# Altium schematic sheet SmokeDetector.SchDoc: Smoke Detector Top Sheet
size A; SheetNumber: 1; SheetTotal: 5
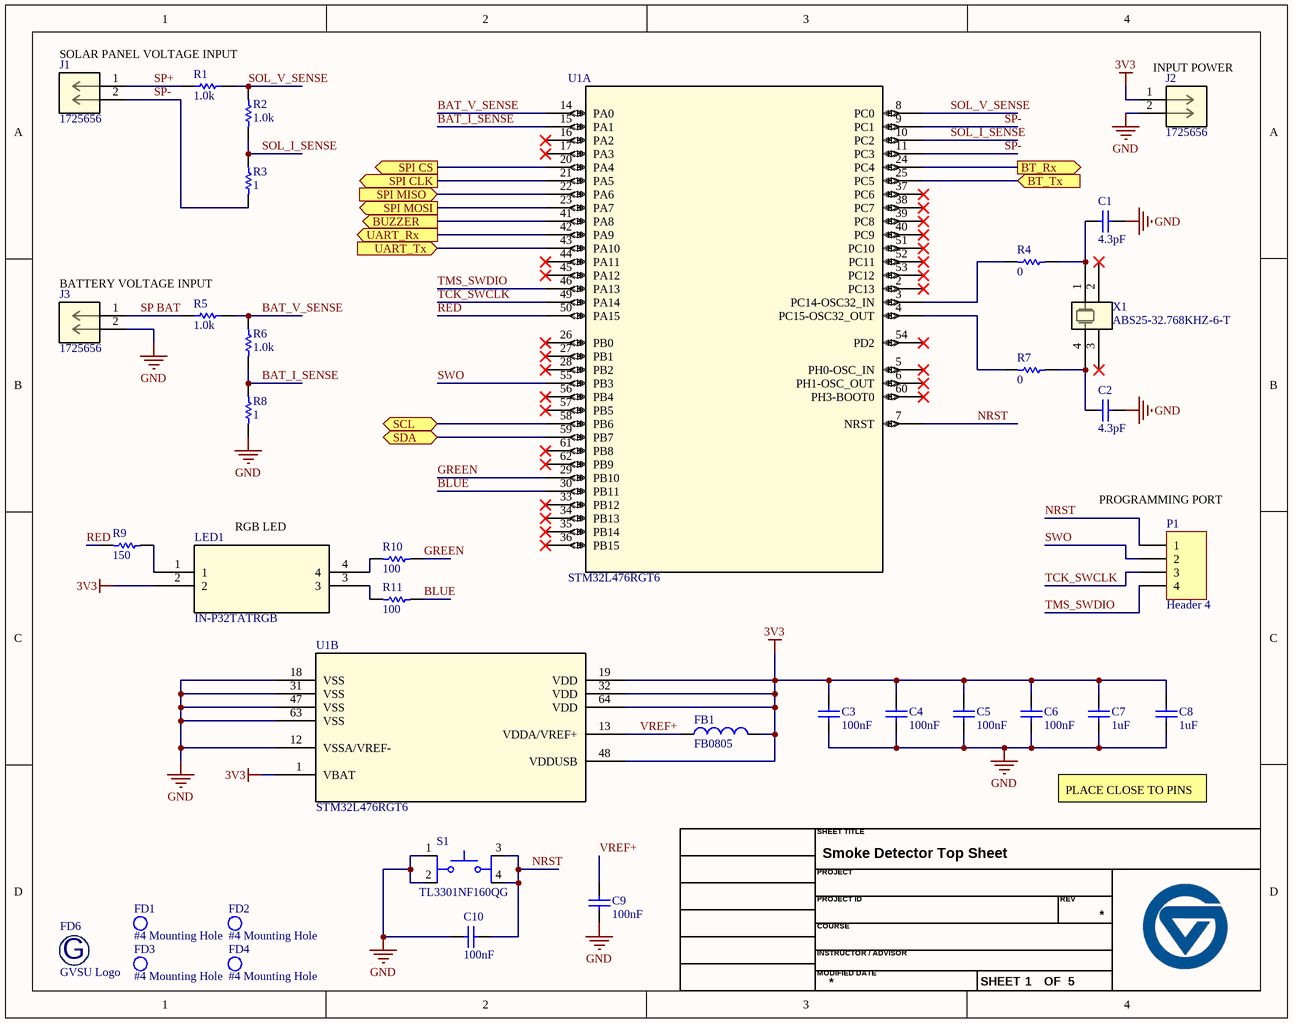
[diagram p0: SmokeDetector.SchDoc]

## Parts
C1  value 4.3pF  [0402cap]  (hidden comment: C0402)
C2  value 4.3pF  [0402cap]  (hidden comment: C0402)
C3  value 100nF  [0402cap]  (hidden comment: C0402)
C4  value 100nF  [0402cap]  (hidden comment: C0402)
C5  value 100nF  [0402cap]  (hidden comment: C0402)
C6  value 100nF  [0402cap]  (hidden comment: C0402)
C7  value 1uF  [0402cap]  (hidden comment: C0402)
C8  value 1uF  [0805CAP]  (hidden comment: C0805)
C9  value 100nF  [0402cap]  (hidden comment: C0402)
C10  value 100nF  [0402cap]  (hidden comment: C0402)
FB1  FB0805  [0805CAP]
FD1  #4 Mounting Hole  [#4 Mounting Hole-Footprint-1]  (no BOM)
FD2  #4 Mounting Hole  [#4 Mounting Hole-Footprint-1]  (no BOM)
FD3  #4 Mounting Hole  [#4 Mounting Hole-Footprint-1]  (no BOM)
FD4  #4 Mounting Hole  [#4 Mounting Hole-Footprint-1]  (no BOM)
FD6  GVSU Logo  [GVSU Symbol Only]  (no BOM)
J1  1725656  [CONN_1725656_PXC]
J2  1725656  [CONN_1725656_PXC]
J3  1725656  [CONN_1725656_PXC]
LED1  IN-P32TATRGB  [4-PLCC_3P2X2P8_INL]
P1  Header 4  [HDR1X4]
R1  value 1.0k  [0805RES]  (hidden comment: R0805)
R2  value 1.0k  [0805RES]  (hidden comment: R0805)
R3  value 1  [0805RES]  (hidden comment: R0805)
R4  value 0  [0402RES]  (hidden comment: R0402)
R5  value 1.0k  [0805RES]  (hidden comment: R0805)
R6  value 1.0k  [0805RES]  (hidden comment: R0805)
R7  value 0  [0402RES]  (hidden comment: R0402)
R8  value 1  [0805RES]  (hidden comment: R0805)
R9  value 150  [0805RES]  (hidden comment: R0805)
R10  value 100  [0805RES]  (hidden comment: R0805)
R11  value 100  [0805RES]  (hidden comment: R0805)
S1  TL3301NF160QG  [SW_TL3301NF160QG]
U1  STM32L476RGT6  [LQFP64-10x10mm_STM]  (parts A,B of 2)
X1  ABS25-32.768KHZ-6-T  [X_ABS25_ABR]

## Ports
BT_Rx (out), BT_Tx (in), BUZZER (out), SCL (bidir), SDA (bidir), SPI CLK (out), SPI CS (out), SPI MISO (in), SPI MOSI (out), UART_Rx (out), UART_Tx (in)

## Nets
3V3: C3.2 C4.2 C5.2 C6.2 C7.2 C8.2 FB1.2 J2.1 LED1.2 U1.1(VBAT) U1.19(VDD) U1.32(VDD) U1.48(VDDUSB) U1.64(VDD)
GND: C1.2 C2.2 C3.1 C4.1 C5.1 C6.1 C7.1 C8.1 C9.1 C10.1 J2.2 J3.2 R8.1 S1.1 S1.2 U1.12(VSSA/VREF-) U1.18(VSS) U1.31(VSS) U1.47(VSS) U1.63(VSS)
BAT_I_SENSE: R6.1 R8.2 U1.15(PA1)
BAT_V_SENSE: R5.1 R6.2 U1.14(PA0)
BLUE: R11.2 U1.30(PB11)
BT_Rx: U1.24(PC4) ; port BT_Rx
BT_Tx: U1.25(PC5) ; port BT_Tx
BUZZER: U1.41(PA8) ; port BUZZER
GREEN: R10.2 U1.29(PB10)
NRST: C10.2 P1.1 S1.3 S1.4 U1.7(NRST)
RED: R9.1 U1.50(PA15)
SCL: U1.58(PB6) ; port SCL
SDA: U1.59(PB7) ; port SDA
SOL_I_SENSE: R2.1 R3.2 U1.10(PC2)
SOL_V_SENSE: R1.1 R2.2 U1.8(PC0)
SP BAT: J3.1 R5.2
SP+: J1.1 R1.2
SP-: J1.2 R3.1 U1.9(PC1) U1.11(PC3)
SPI CLK: U1.21(PA5) ; port SPI CLK
SPI CS: U1.20(PA4) ; port SPI CS
SPI MISO: U1.22(PA6) ; port SPI MISO
SPI MOSI: U1.23(PA7) ; port SPI MOSI
SWO: P1.2 U1.55(PB3)
TCK_SWCLK: P1.3 U1.49(PA14)
TMS_SWDIO: P1.4 U1.46(PA13)
UART_Rx: U1.42(PA9) ; port UART_Rx
UART_Tx: U1.43(PA10) ; port UART_Tx
VREF+: C9.2 FB1.1 U1.13(VDDA/VREF+)
NetC1_1: C1.1 R4.2 X1.1(CRYSTAL)
NetC2_1: C2.1 R7.2 X1.4(CRYSTAL)
NetLED1_1: LED1.1 R9.2
NetLED1_3: LED1.3 R11.1
NetLED1_4: LED1.4 R10.1
NetR4_1: R4.1 U1.3(PC14-OSC32_IN)
NetR7_1: R7.1 U1.4(PC15-OSC32_OUT)

Not connected (* = marked no-connect by the designer): U1 2(PC13)* 5(PH0-OSC_IN)* 6(PH1-OSC_OUT)* 16(PA2)* 17(PA3)* 26(PB0)* 27(PB1)* 28(PB2)* 33(PB12)* 34(PB13)* 35(PB14)* 36(PB15)* 37(PC6)* 38(PC7)* 39(PC8)* 40(PC9)* 44(PA11)* 45(PA12)* 51(PC10)* 52(PC11)* 53(PC12)* 54(PD2)* 56(PB4)* 57(PB5)* 60(PH3-BOOT0)* 61(PB8)* 62(PB9)*; X1 2(NC)* 3(NC)*

## Notes on the sheet
- SOLAR PANEL VOLTAGE INPUT
- (near J2) INPUT POWER
- BATTERY VOLTAGE INPUT
- (near P1) PROGRAMMING PORT
- (near LED1) RGB LED
- PLACE CLOSE TO PINS
- SHEET TITLE
- PROJECT
- PROJECT ID
- REV
- COURSE
- INSTRUCTOR / ADVISOR
- MODIFIED DATE
- SHEET
- OF
- (in symbol GVSU Logo) G

## Library data of the parts
C1-C7 C9 C10 = C0402: 0402 Ceramic Chip Capacitor - Standard
C8 = C0805: 0805 Ceramic Chip Capacitor - Standard
FB1 = FB0805: 0805 Multilayer Ferrite Power Bead; Manufacturer: KOA Speer; Manufacturer P/N: CAP2AFTTD221P; Vendor: Mouser; Vendor P/N: 660-CZP2AFTTD221P; Resistance @ 100MHz: 220; Price: 0.15
FD1-FD4 = #4 Mounting Hole: #4 clearance hole, unplated.
FD6 = GVSU Logo: GVSU Logo (Several Symbols)
J1-J3 = 1725656: No Description Available; Mfr_Name: Phoenix Contact; RefDes: RefDes; Type: Type
LED1 = IN-P32TATRGB: No Description Available; Mfr_Name: Inolux; RefDes: RefDes; Type: Type
P1 = Header 4: Header, 4-Pin; LatestRevisionDate: 17-Jul-2002; LatestRevisionNote: Re-released for DXP Platform.; Publisher: Altium Limited
R1-R3 R5 R6 R8-R11 = R0805: 0805 Chip Resistor - Standard
R4 R7 = R0402: 0402 Chip Resistor - Standard; ComponentLink1URL: *
S1 = TL3301NF160QG: <a href="https://pricing.snapeda.com/parts/TL3301NF160QG/E-Switch/view-part?ref=eda">Check availability</a> <a href="https://pricing.snapeda.com/parts/TL3301NF160QG/E-Switch/view-part?ref=eda">Check availability</a>; MF: {'manufacturer': u'E-Switch'}; Package: None; Price: None; Value: *; MP: TL3301NF160QG; Availability: Unavailable
U1 = STM32L476RGT6: No Description Available; Mfr_Name: STMicroelectronics; RefDes: RefDes; Type: Type
X1 = ABS25-32.768KHZ-6-T: No Description Available; Mfr_Name: Abracon; Type: Crystals; RefDes: RefDes